# Altium project ReflowIron-01-logic.PrjPcb
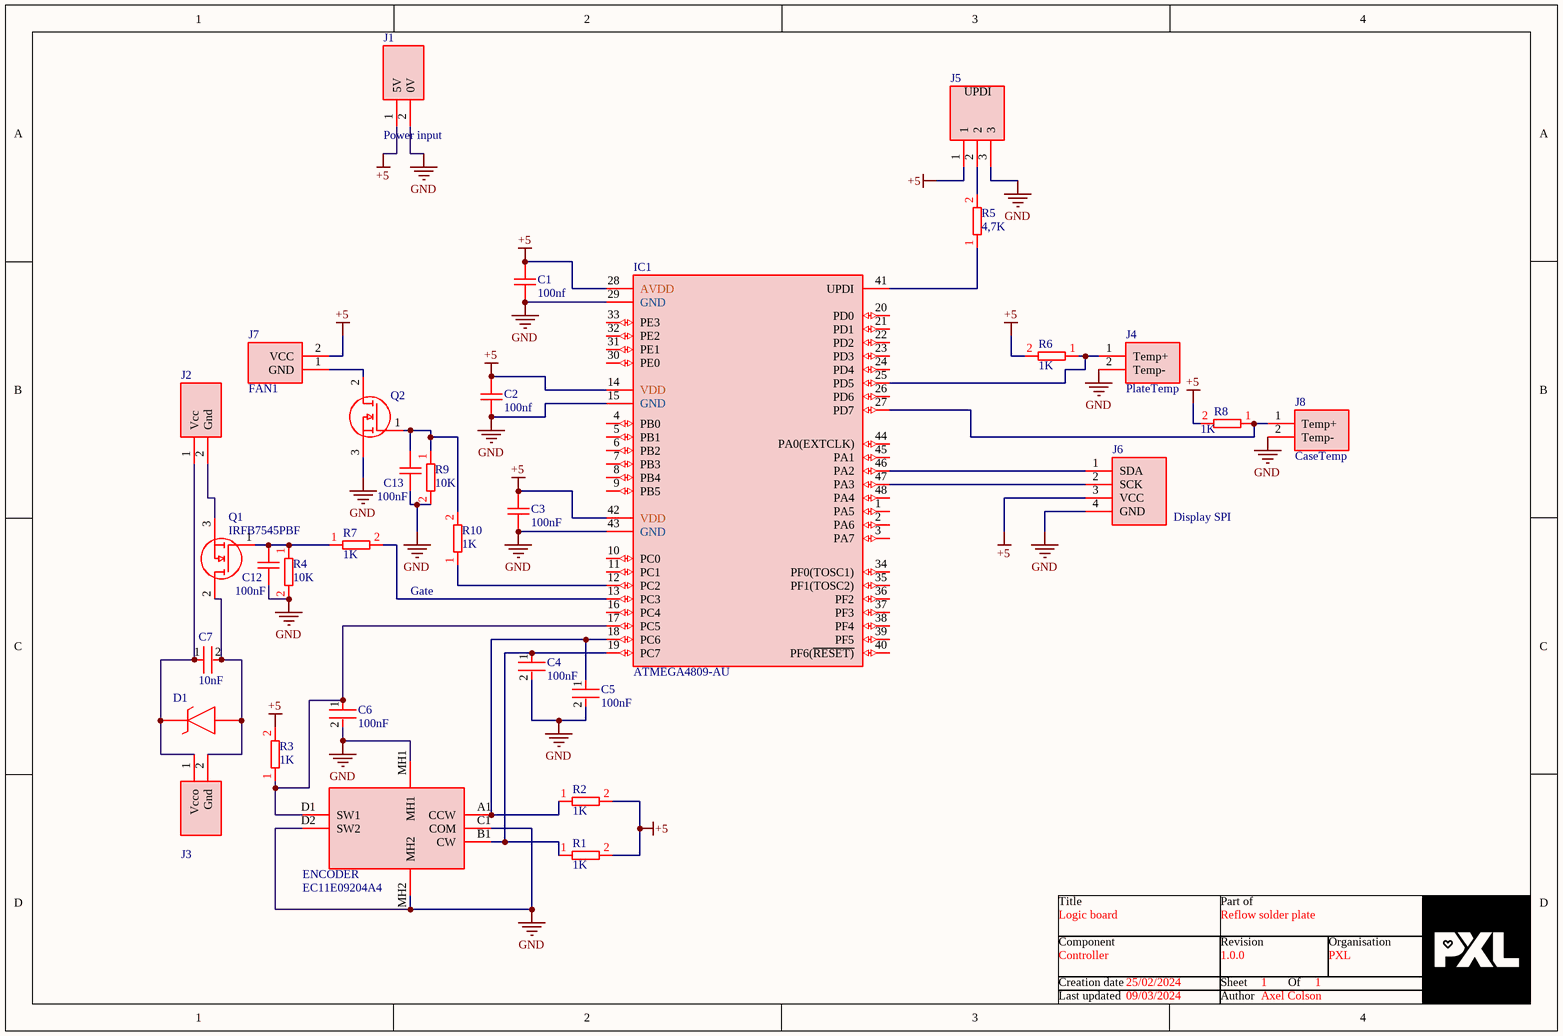
[diagram p0: controller-ic.SchDoc]
1 sheet, 32 parts. Net scope: global (net labels, ports and power ports of the same name join across sheets).
Board file: ControlBoard.PcbDoc

## Sheet controller-ic.SchDoc: Logic board
size A4; Date: 5/03/2024; Author: Axel Colson; CompanyName: PXL; Organization: PXL; Revision: 1.0.0; SheetNumber: 1; SheetTotal: 1; Component: Controller; PartOf: Reflow solder plate; CreatedAt: 25/02/2024; LastUpdated: 09/03/2024

### Parts
C1  100nf  [CAP_0603US-IPC_C]
C2  100nf  [CAP_0603US-IPC_C]
C3  100nF  [CAP_0603US-IPC_C]
C4  100nF  [CAP_0603US-IPC_C]
C5  100nF  [CAP_0603US-IPC_C]
C6  100nF  [CAP_0603US-IPC_C]
C7  10nF  [CAP_0603US-IPC_C]
C12  100nF  [CAP_0603US-IPC_C]
C13  100nF  [CAP_0603US-IPC_C]
D1  ZENER_TH  [ZENER_SMF_DO219AB]  (value not drawn)
ENCODER  EC11E09204A4  [ENC_ROT_EC11]
IC1  ATMEGA4809-AU  [IC_ATmega4809AF-IPC_A]
J1  Power input  [CON_M1x2PIN_SHROUDED]
J2  CON_F1x2Pin  [CON_M1x2PIN_SHROUDED]  (value not drawn)
J3  CON_F1x2Pin  [CON_M1x2PIN_SHROUDED]  (value not drawn)
J4  PlateTemp  [CON_M1x2PIN_SHROUDED]
J5  Use: UPDI  [CON_M1x3PIN]  (hidden comment: 890-70-003-10-001101)
J6  CON_M1x4Pin  [CON_M1x4PIN_Shrouded]  (value not drawn)
J7  FAN1  [CON_M1X2PIN_CLAMP]
J8  CaseTemp  [CON_M1X2PIN_CLAMP]
Q1  IRFB7545PBF  [MOSFET_TO254P483X1016X1994]
Q2  IRFB7545PBF  [MOSFET_SOT23_MMFTN6001]  (value not drawn)
R1  1K  [RES_0603US_TF-IPC_C]
R2  1K  [RES_0603US_TF-IPC_C]
R3  1K  [RES_0603US_TF-IPC_C]
R4  10K  [RES_0603US_TF-IPC_C]
R5  4,7K  [RES_0603US_TF-IPC_C]
R6  1K  [RES_0603US_TF-IPC_C]
R7  1K  [RES_0603US_TF-IPC_C]
R8  1K  [RES_0603US_TF-IPC_C]
R9  10K  [RES_0603US_TF-IPC_C]
R10  1K  [RES_0603US_TF-IPC_C]

### Nets
+5: C1.2 C2.2 C3.2 IC1.14(VDD) IC1.28(AVDD) IC1.42(VDD) J1.1(5V) J5.1 J6.3(VCC) J7.2(VCC) R1.2 R2.2 R3.2 R6.2 R8.2
GND: C1.1 C2.1 C3.1 C4.2 C5.2 C6.2 C12.1 C13.1 ENCODER.C1(COM) ENCODER.D2(SW2) ENCODER.MH1 ENCODER.MH2 IC1.15(GND) IC1.29(GND) IC1.43(GND) J1.2(0V) J4.2(Temp-) J5.3 J6.4(GND) J8.2(Temp-) Q2.3(S) R4.2 R9.2
NetC4_1: C4.1 ENCODER.B1(CW) IC1.19(PC7) R1.1
NetC5_1: C5.1 ENCODER.A1(CCW) IC1.18(PC6) R2.1
NetC6_1: C6.1 ENCODER.D1(SW1) IC1.17(PC5) R3.1
NetC7_1: C7.1 D1.1(K) J2.1(Vcc) J3.1(Vcco)
NetC7_2: C7.2 D1.2(A) J3.2(Gnd) Q1.2(D)
NetC12_2: C12.2 Q1.1(G) R4.1 R7.1
NetC13_2: C13.2 Q2.1(G) R9.1 R10.2
NetIC1_12: IC1.12(PC2) R10.1
NetIC1_13: IC1.13(PC3) R7.2
NetIC1_25: IC1.25(PD5) J4.1(Temp+) R6.1
NetIC1_27: IC1.27(PD7) J8.1(Temp+) R8.1
NetIC1_41: IC1.41(UPDI) R5.1
NetIC1_46: IC1.46(PA2) J6.1(SDA)
NetIC1_47: IC1.47(PA3) J6.2(SCK)
NetJ2_2: J2.2(Gnd) Q1.3(S)
NetJ5_2: J5.2 R5.2
NetJ7_1: J7.1(GND) Q2.2(D)

Not connected (* = marked no-connect by the designer): IC1 1(PA5) 2(PA6) 3(PA7) 4(PB0) 5(PB1) 6(PB2) 7(PB3) 8(PB4) 9(PB5) 10(PC0) 11(PC1) 16(PC4) 20(PD0) 21(PD1) 22(PD2) 23(PD3) 24(PD4) 26(PD6) 30(PE0) 31(PE1) 32(PE2) 33(PE3) 34(PF0(TOSC1)) 35(PF1(TOSC2)) 36(PF2) 37(PF3) 38(PF4) 39(PF5) 40(PF6(~{RESET)}) 44(PA0(EXTCLK)) 45(PA1) 48(PA4)

### Notes on the sheet
- Display SPI
- Gate
- Title
- Part of
- Component
- Creation date
- Revision
- Sheet
- Of
- Organisation
- Last updated
- Author

### Library data of the parts
C1-C3 C12 C13 = D_Capacitor_0805CC: Manufacturer: AVX Interconnect / Elco; Part Number: 08051C103JAT2A
C4-C6 = D_Capacitor_0603CC: CAP CER 0.1UF 25V X7R 0603; Tolerance: 10%; Voltage Rating (DC): 25V; Dielectric: X7R; Packaging: Tape and Reel; RoHS Compliant: Yes; Capacitance: 100nF; Case Code (Imperial): 0603; Depth: 0.8mm; Voltage Rating: 25V; Case Code (Metric): 1608; Lead Free: Lead Free; Min Operating Temperature: -55°C; Max Operating Temperature: 125°C; Length: 1.6mm; Case/Package: Ceramic; Radiation Hardening: No
C7 = D_Capacitor_0603CC: CAP CER 0.1UF 25V X7R 0603; Tolerance: 10%; Capacitance: 100nF; Voltage Rating (DC): 25V; Dielectric: X7R; Packaging: Tape and Reel; RoHS Compliant: Yes; Case Code (Imperial): 0603; Depth: 0.8mm; Voltage Rating: 25V; Case Code (Metric): 1608; Lead Free: Lead Free; Min Operating Temperature: -55°C; Max Operating Temperature: 125°C; Length: 1.6mm; Case/Package: Ceramic; Radiation Hardening: No
ENCODER = ENC_ROTEC11E09: Mechanical Encoder Rotary Incremental Flat 0.01N.m Straight Quadrature Digital Square Wave 9PPR Through Hole PC Pin Automotive; Manufacturer_Name: ALPS Electric; Geometry.Height: 24.5mm; Mouser Part Number: 688-EC11E09204A4; Mouser Price/Stock: https://www.mouser.co.uk/ProductDetail/Alps-Alpine/EC11E09204A4?qs=PoKhxlfUXjKXlta7xVJCmA%3D%3D; Manufacturer_Part_Number: EC11E09204A4; Datasheet Link: https://componentsearchengine.com/Datasheets/2/EC11E09204A4.pdf
IC1 = IC_ATMega4809: MCU 8-BIT; Peripherals: Brown-out Detect/Reset; Number of I/Os: 41; Core Architecture: AVR; Memory Size: 48KB; Interface: I2C; Oscillator Type: Internal; Memory Type: FLASH; Series: megaAVR® 0, Functional Safety (FuSa); Min Operating Temperature: -40°C; Mount: Surface Mount; Case/Package: TQFP; RoHS Compliant: Yes; Max Operating Temperature: 85°C
J1 = CON_F1x3Pin: Connector; Manufacturer_Name: Adam Tech; Manufacturer_Part_Number: SMC-1-02-1-GT; Datasheet Link: https://app.adam-tech.com/products/download/data_sheet/203379/smc-1-xx-1-gt-data-sheet.pdf; Height: 4.381mm; Arrow Part Number: SMC-1-02-1-GT; Arrow Price/Stock: https://www.arrow.com/en/products/smc-1-02-1-gt/adam-tech
J2 J4 J7 J8 = CON_F1x2Pin: Connector; Manufacturer_Name: Adam Tech; Manufacturer_Part_Number: SMC-1-02-1-GT; Datasheet Link: https://app.adam-tech.com/products/download/data_sheet/203379/smc-1-xx-1-gt-data-sheet.pdf; Height: 4.381mm; Arrow Part Number: SMC-1-02-1-GT; Arrow Price/Stock: https://www.arrow.com/en/products/smc-1-02-1-gt/adam-tech
J3 = CON_F1x2Pin: Gated signal; Manufacturer_Name: Adam Tech; Manufacturer_Part_Number: SMC-1-02-1-GT; Datasheet Link: https://app.adam-tech.com/products/download/data_sheet/203379/smc-1-xx-1-gt-data-sheet.pdf; Height: 4.381mm; Arrow Part Number: SMC-1-02-1-GT; Arrow Price/Stock: https://www.arrow.com/en/products/smc-1-02-1-gt/adam-tech
J5 = CON_3pin: Headers & Wire Housings; Manufacturer_Name: Preci-Dip; Geometry.Height: 8.54mm; Mouser Part Number: *; Mouser Price/Stock: *; Manufacturer_Part_Number: 890-70-003-10-001101; Datasheet Link: https://www.precidip.com/en/Products/PCB-Connectors/pview/890-PP-NNN-10-001101.html
Q1 Q2 = MOSFET_IRFB745PBF: IRFB7545PBF N-Channel MOSFET, 95 A, 60 V StrongIRFET, 3-Pin TO-220AB Infineon; Geometry.Height: 4.83mm; Mouser Part Number: 942-IRFB7545PBF; Mouser Price/Stock: https://www.mouser.co.uk/ProductDetail/Infineon-Technologies/IRFB7545PBF?qs=a7rcPCEf1Q%252BjvB7f7k7q9g%3D%3D; Manufacturer_Name: Infineon; Manufacturer_Part_Number: IRFB7545PBF; Datasheet Link: *
R1-R10 = D_Resistor_TF0603: SMD 0603 Thick Film 4.7kΩ 5.00% 0.1W; Voltage Rating: 50V; Max Power Dissipation: 100mW; Temperature Coefficient: 100ppm/°C; Resistance: 4.7kR; Tolerance: 5%; Width: 0.8mm; Case Code (Metric): 1608; Termination: SMD/SMT; Case/Package: 0603; Series: AC; Max Operating Temperature: 155°C; Length: 1.6mm; Resistor Type: Thick Film; Ratings: AEC-Q200; Weight: 7.1E-05oz; Case Code (Imperial): 0603; Features: Moisture Resistant; Packaging: Tape and Reel; Min Operating Temperature: -55°C; Number of Terminations: 2; RoHS Compliant: Yes; Lead Free: Lead Free; Height: 0.45mm; Power Rating: 100mW